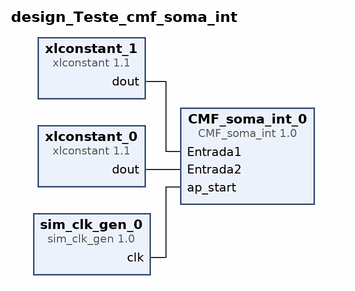
[diagram p0: block diagram of the top level]
# Vivado block design design_Teste_cmf_soma_int, xc7z020clg484-1, Vivado 2018.3
create_bd_design design_Teste_cmf_soma_int

create_bd_cell -type ip -vlnv xilinx.com:user:CMF_soma_int:1.0 CMF_soma_int_0
create_bd_cell -type ip -vlnv xilinx.com:ip:xlconstant:1.1 xlconstant_0
set_property -dict {CONFIG.CONST_VAL 3 CONFIG.CONST_WIDTH 32} [get_bd_cells xlconstant_0]
create_bd_cell -type ip -vlnv xilinx.com:ip:xlconstant:1.1 xlconstant_1
set_property -dict {CONFIG.CONST_VAL 5 CONFIG.CONST_WIDTH 32} [get_bd_cells xlconstant_1]
create_bd_cell -type ip -vlnv xilinx.com:ip:sim_clk_gen:1.0 sim_clk_gen_0
set_property -dict {CONFIG.RESET_POLARITY ACTIVE_HIGH} [get_bd_cells sim_clk_gen_0]

# ---- connections ----

connect_bd_net [get_bd_pins xlconstant_1/dout] [get_bd_pins CMF_soma_int_0/Entrada1]
connect_bd_net [get_bd_pins xlconstant_0/dout] [get_bd_pins CMF_soma_int_0/Entrada2]
connect_bd_net [get_bd_pins sim_clk_gen_0/clk] [get_bd_pins CMF_soma_int_0/ap_start]

validate_bd_design
save_bd_design
